# Altium schematic sheet MagicWand_Schematic.SchDoc
size A4; SheetNumber: 1; SheetTotal: 1
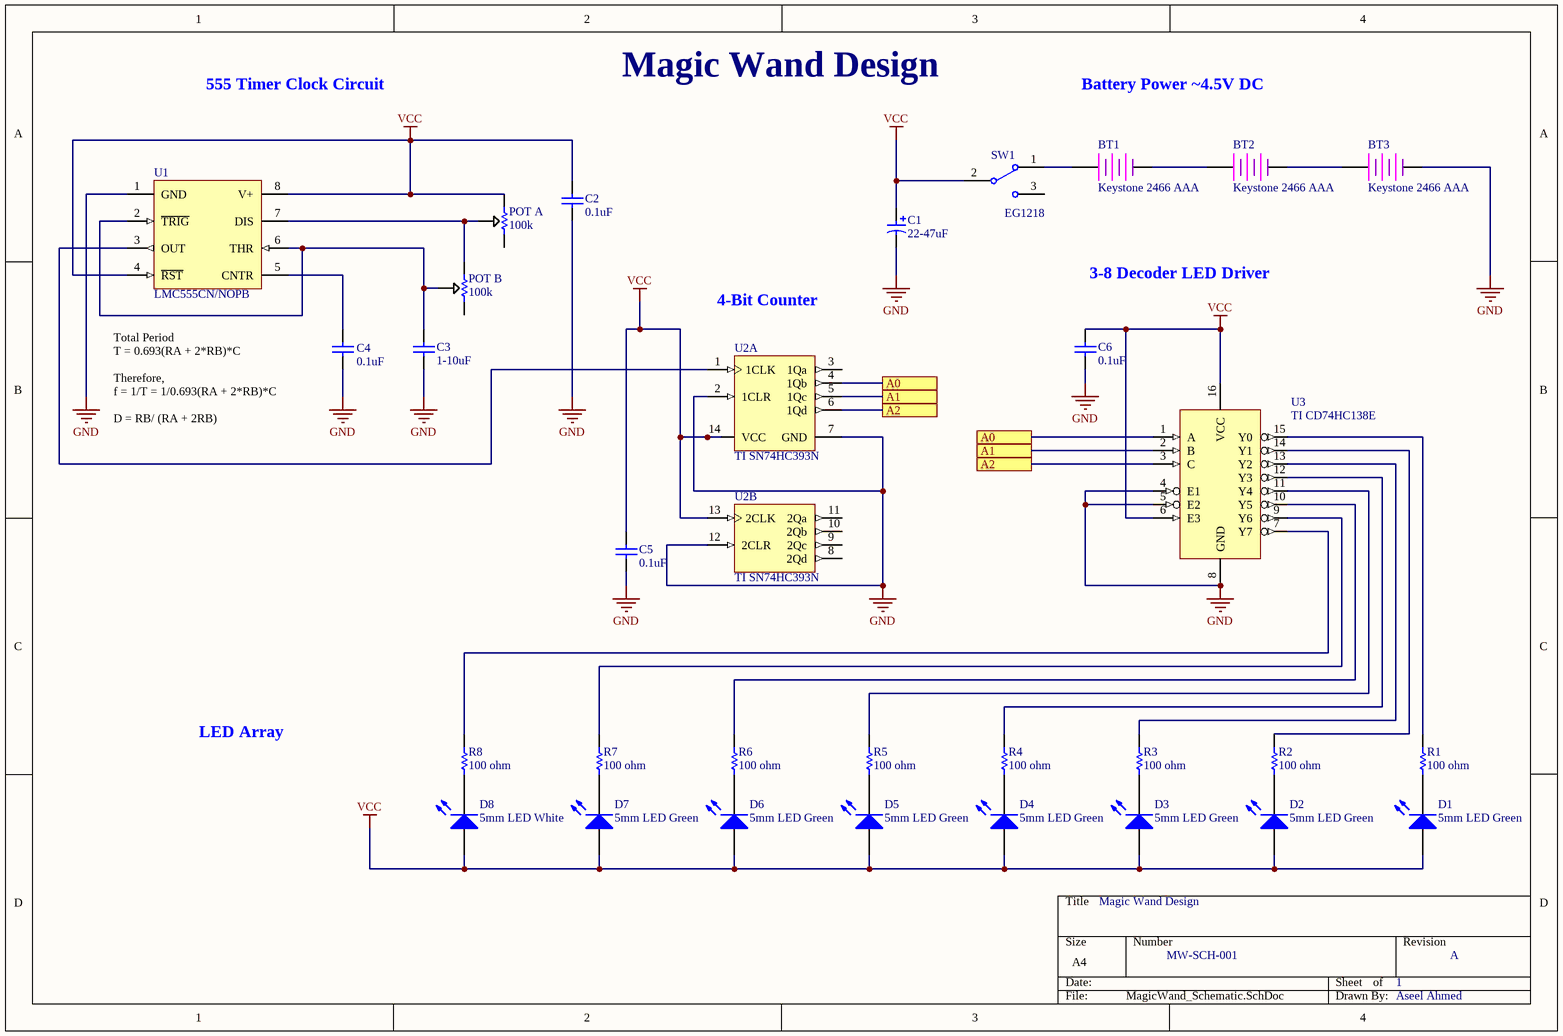
[diagram p0: MagicWand_Schematic.SchDoc]

## Parts
BT1  Keystone 2466 AAA  [PCB-2466]
BT2  Keystone 2466 AAA  [PCB-2466]
BT3  Keystone 2466 AAA  [PCB-2466]
C1  22-47uF  [PCB-xswzn1jk2ejoevwvaoxh-1]
C2  0.1uF  [PCB-ql28fbuo3tond8refhb5-1]
C3  1-10uF  [PCB-ql28fbuo3tond8refhb5-1]
C4  0.1uF  [PCB-ql28fbuo3tond8refhb5-1]
C5  0.1uF  [PCB-ql28fbuo3tond8refhb5-1]
C6  0.1uF  [PCB-ql28fbuo3tond8refhb5-1]
D1  5mm LED Green  [PCB-6hmn14p3euwrtpae4j9f-1]
D2  5mm LED Green  [PCB-6hmn14p3euwrtpae4j9f-1]
D3  5mm LED Green  [PCB-6hmn14p3euwrtpae4j9f-1]
D4  5mm LED Green  [PCB-6hmn14p3euwrtpae4j9f-1]
D5  5mm LED Green  [PCB-6hmn14p3euwrtpae4j9f-1]
D6  5mm LED Green  [PCB-6hmn14p3euwrtpae4j9f-1]
D7  5mm LED Green  [PCB-6hmn14p3euwrtpae4j9f-1]
D8  5mm LED White  [PCB-6hmn14p3euwrtpae4j9f-1]
POT_A  100k  [PCB-1580288-1]
POT_B  100k  [PCB-1580288-1]
R1  100 ohm  [PCB-0jk5y5qyb1smy9vf6b7t-1]
R2  100 ohm  [PCB-0jk5y5qyb1smy9vf6b7t-1]
R3  100 ohm  [PCB-0jk5y5qyb1smy9vf6b7t-1]
R4  100 ohm  [PCB-0jk5y5qyb1smy9vf6b7t-1]
R5  100 ohm  [PCB-0jk5y5qyb1smy9vf6b7t-1]
R6  100 ohm  [PCB-0jk5y5qyb1smy9vf6b7t-1]
R7  100 ohm  [PCB-0jk5y5qyb1smy9vf6b7t-1]
R8  100 ohm  [PCB-0jk5y5qyb1smy9vf6b7t-1]
SW1  EG1218  [ESWI-EG1218_V]
U1  LMC555CN/NOPB  [N08E]
U2  TI SN74HC393N  [PCB-te1ukpb7ypv15gwynu8x-1]  (parts A,B of 2)
U3  TI CD74HC138E  [PCB-iqyivjlmuk83cucpld0n-1]

## Ports
A0, A1, A2

## Nets
GND: BT3.2(-) C1.2 C2.1 C3.1 C4.1 C5.1 C6.1 U1.1(GND) U2.2(1CLR) U2.7(GND) U2.12(2CLR) U3.4(E1) U3.5(E2) U3.8(GND)
VCC: C1.1 C2.2 C5.2 C6.2 D1.1(A) D2.1(A) D3.1(A) D4.1(A) D5.1(A) D6.1(A) D7.1(A) D8.1(A) POT_A.2 SW1.2(COM) U1.4(~{RST}) U1.8(V+) U2.13(2CLK) U2.14(VCC) U3.6(E3) U3.16(VCC)
A0: U2.4(1Qb) U3.1(A) ; port A0
A1: U2.5(1Qc) U3.2(B) ; port A1
A2: U2.6(1Qd) U3.3(C) ; port A2
NetBT1_1: BT1.1(+) SW1.1
NetBT1_2: BT1.2(-) BT2.1(+)
NetBT2_2: BT2.2(-) BT3.1(+)
NetC3_2: C3.2 POT_B.3 U1.2(~{TRIG}) U1.6(THR)
NetC4_2: C4.2 U1.5(CNTR)
NetD1_2: D1.2(K) R1.1
NetD2_2: D2.2(K) R2.1
NetD3_2: D3.2(K) R3.1
NetD4_2: D4.2(K) R4.1
NetD5_2: D5.2(K) R5.1
NetD6_2: D6.2(K) R6.1
NetD7_2: D7.2(K) R7.1
NetD8_2: D8.2(K) R8.1
NetPOT_A_3: POT_A.3 POT_B.2 U1.7(DIS)
NetR1_2: R1.2 U3.15(Y0)
NetR2_2: R2.2 U3.14(Y1)
NetR3_2: R3.2 U3.13(Y2)
NetR4_2: R4.2 U3.12(Y3)
NetR5_2: R5.2 U3.11(Y4)
NetR6_2: R6.2 U3.10(Y5)
NetR7_2: R7.2 U3.9(Y6)
NetR8_2: R8.2 U3.7(Y7)
NetU1_3: U1.3(OUT) U2.1(1CLK)

Not connected (* = marked no-connect by the designer): POT_A 1; POT_B 1; SW1 3; U2 3(1Qa) 8(2Qd) 9(2Qc) 10(2Qb) 11(2Qa)

## Notes on the sheet
- 555 Timer Clock Circuit
- Magic Wand Design
- Battery Power ~4.5V DC
- 4-Bit Counter
- 3-8 Decoder LED Driver
- Total Period
  T = 0.693(RA + 2*RB)*C
  Therefore,
  f = 1/T = 1/0.693(RA + 2*RB)*C
  D = RB/ (RA + 2RB)
- LED Array
- MW-SCH-001
- 1
- A
- Aseel Ahmed

## Library data of the parts
BT1-BT3 = CMP-3612-22: Battery holder, AAA, 1 cell, PC mount; Manufacturer Part Number: 2466; Manufacturer Name: Keystone Electronics; Lead-Free Status: Lead Free; OctopartID: fe0e3705da2821c9; Supplier Name: Digikey; Supplier PN: 36-2466-ND; Contact Plating: Nickel; RoHS: Compliant; Material: Plastic; Supplier URL: https://www.digikey.ca/product-detail/en/keystone-electronics/2466/36-2466-ND/303815; Octopart Url: https://octopart.com/2466-keystone-65856
C1 = CMP-b868704b0d3c67af-17: Electrolytic capacitor Radial lead 2.5 mm 10 µF 16 V 20 % (Ø) 4 mm Panasonic EEA-GA1C100H 1 pc(s); OctopartID: b868704b0d3c67af
C2-C6 = CMP-1272d9258f2acdb5-7: K 100nF Ceramic Multilayer Capacitor, 50 V dc, +125degC, X7R Dielectric, +/-10%
D1-D8 = CMP-4a898382afec954e-1: Green 5 mm 60° Diffused 30 mcd 2.2 V Through Hole LED - T-1¾; Manufacturer Part Number: SSL-LX5093PGD; Peak Wavelength: 555 nm; Forward Voltage: 2.20 V; Luminous Intensity: 30.0 mcd; Lead-Free Status: Lead Free; Lens Color: Green; Size-Height: 8.60 mm; Octopart URL: https://octopart.com/ssl-lx5093pgd-lumex-114691; Size-Diameter: 5.00 mm; Color: Green; Lens Type: Diffused; OctopartID: 4a898382afec954e; Operating Temperature: 85.0 °C (max); Wavelength: 555 nm; Mounting Style: Through Hole, Vertical; Number of Pins: 2; Footprint: PCB-6hmn14p3euwrtpae4j9f-3; RoHS: Compliant; Viewing Angle: 60 °; Packaging: Bulk
POT_A POT_B = CMP-32ccf8683850ed0b-6: Res Cermet Trimmer 10K Ohm 10% 1/2W 1(Elec)/1(Mech)Turn 2.6mm (7 X 7 X 5.8mm) Pin Thru-Hole Bulk; Manufacturer Part Number: CT6EP103; Power Rating: 500 mW; Temperature Coefficient: -100 ppm/°C to 100 ppm/°C; Resistance: 10.0 kΩ; Lead-Free Status: Lead Free; Size-Width: 7.00 mm; OctopartID: 32ccf8683850ed0b; Weight: 510 mg; RoHS: Compliant; Operating Temperature: 120 °C (max); Octopart URL: https://octopart.com/ct6ep103-nidec+copal-61747194; Mounting Style: Through Hole; Size-Length: 7.00 mm; Color: Blue; Size-Height: 5.80 mm; Footprint: PCB-d3jnb4bra81w03ke2js5-1; Resistance Tolerance: ±10%; Packaging: Bulk
R1-R8 = CMP-db3e1311f37e04f9-12: Res, 10K, 250mW, 5%, Axial
SW1 = CMP-9a5a5340a2f5459d-18: Slide Switch, 500 V, -20 to 70 degC, 3-Pin THD, RoHS; Current Rating: 200 mA; Number of Positions: 2; Actuator Type: Standard; Contacts Type: SPDT; Lead-Free Status: Lead Free; DatasheetVersion: Oct-15; Size-Length: 2.03 mm; Size-Height: 5.40 mm; OctopartID: 9a5a5340a2f5459d; PackageDescription: 3-Pin Through Hole Device, Body 11.6 x 4 mm, Pitch 2.5 mm; Contact Plating: Silver; Contact Material: Copper Alloy; Packaging: Bulk; Manufacturer Part Number: EG1218; Mounting Style: PCB, Through Hole; Size-Width: 4.00 mm; RoHS: Compliant; PackageReference: EG1218; Seller Landing  Url: https://octopart-clicks.com/click/track?country=US&ak=8157f166&sig=0e9adab&sid=459&ppid=1056201&vpid=1179261&ct=offers; Octopart Url: http://octopart.com/eg1218-e-switch-1056201; Orientation: Vertical
U1 = CMP-0056-00025-14: CMOS Timer, 8-pin MDIP, Pb-Free; Lead-Free Status: Lead Free; Quiescent Current: 5e-05 A; Frequency: 3000000.0 Hz; Lifecycle Status: Active; Manufacturer Part Number: LMC555CN/NOPB; Number of Pins: 8; RoHS: Compliant; Packaging: Tube; OctopartID: 3409fc79b713ebce; Octopart Url: https://octopart.com/lmc555cn%2Fnopb-texas+instruments-24815228; Mounting Style: Through Hole
U2 = CMP-3c53f5596157e394-2: Texas Instruments - SN74HC393N - Counter/Divider Dual 4-Bit Binary UP 14-Pin PDIP Tube; Voltage Nodes: 2.00 V, 6.00 V, 5.00 V; Clock Speed: 60.0 MHz; Lead-Free Status: Lead Free; Number of Bits: 4; Output Current Drive: -1.00 mA; Supply Voltage (DC): 2.00 V to 6.00 V; REACH SVHC Compliance: No SVHC; Case/Package: PDIP; RoHS: Compliant; Packaging: Tube; OctopartID: 3c53f5596157e394; Mounting Style: Through Hole; Octopart URL: https://octopart.com/sn74hc393n-texas+instruments-30818; Lifecycle Status: Active; Number of Pins: 14; Operating Temperature: -40.0 °C to 85.0 °C; Manufacturer Part Number: SN74HC393N
U3 = CMP-1166716-8: TEXAS INSTRUMENTS   CD74HC138E   Logic Type:Decoder / Demultiplexer; Propagation Delay: 265 ns; Output Current: 5.2 mA; Lead-Free Status: Lead Free; Operating Supply Voltage: 2 V to 6 V; Number of Bits: 8; Number of Circuits: 1; Operating Supply Voltage (typical): 2.5V / 3.3V / 5.0V; Octopart Url: https://octopart.com/cd74hc138e-harris-4046706; REACH SVHC Compliance: No SVHC; Operating Temperature: -55C to 125C; Package: PDIP; Manufacturer: Texas Instruments; Mounting Style: Through Hole; Number of Outputs: 8; RoHS: Compliant; Packaging: Tube; Manufacturer Part Number: CD74HC138E; OctopartID: 2c46e54acdf8f381; Number of Pins: 16; Lifecycle Status: Active